# EAGLE design PCB-GPI-JACK (EAGLE 7.7.0)

## Sheet 1 of 2
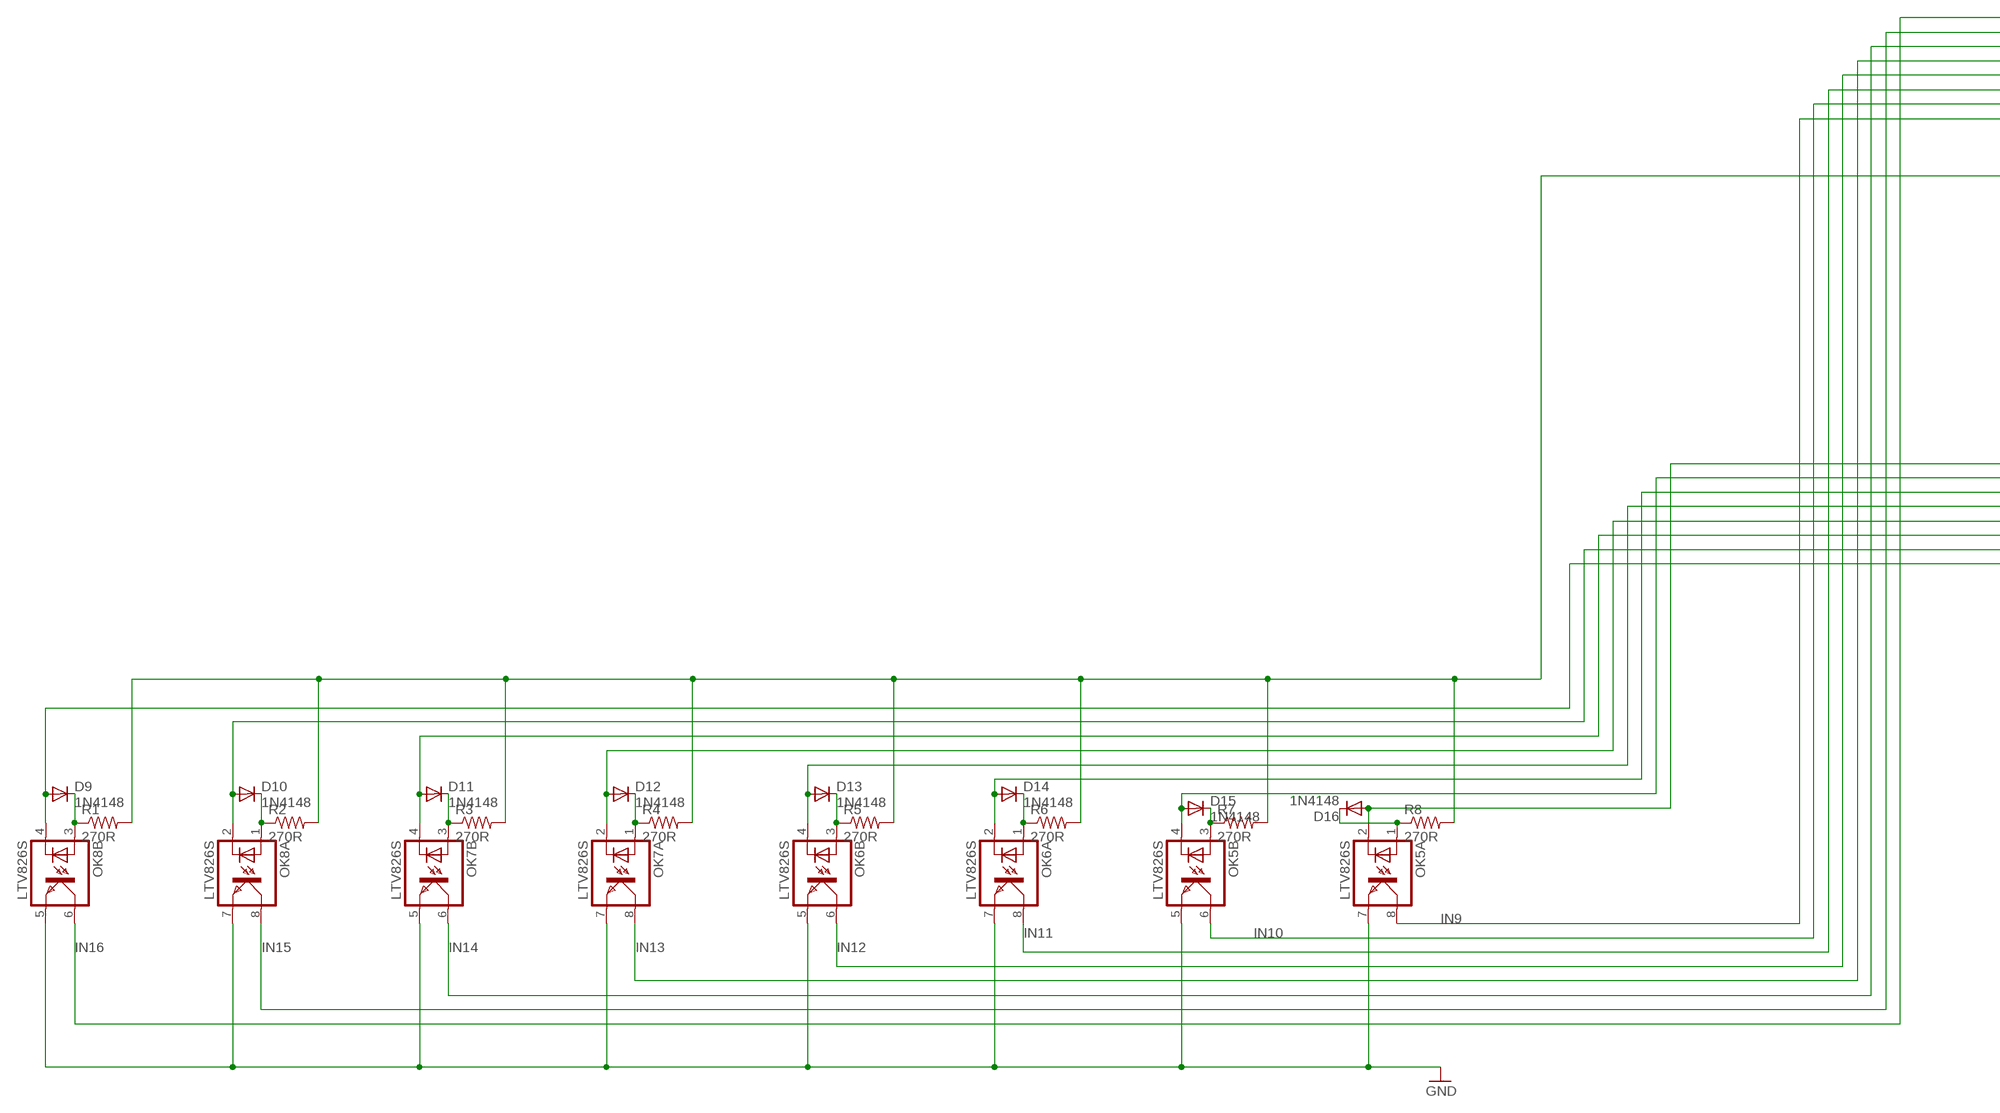
[diagram p0: schematic, sheet 1, part 1 of 2]
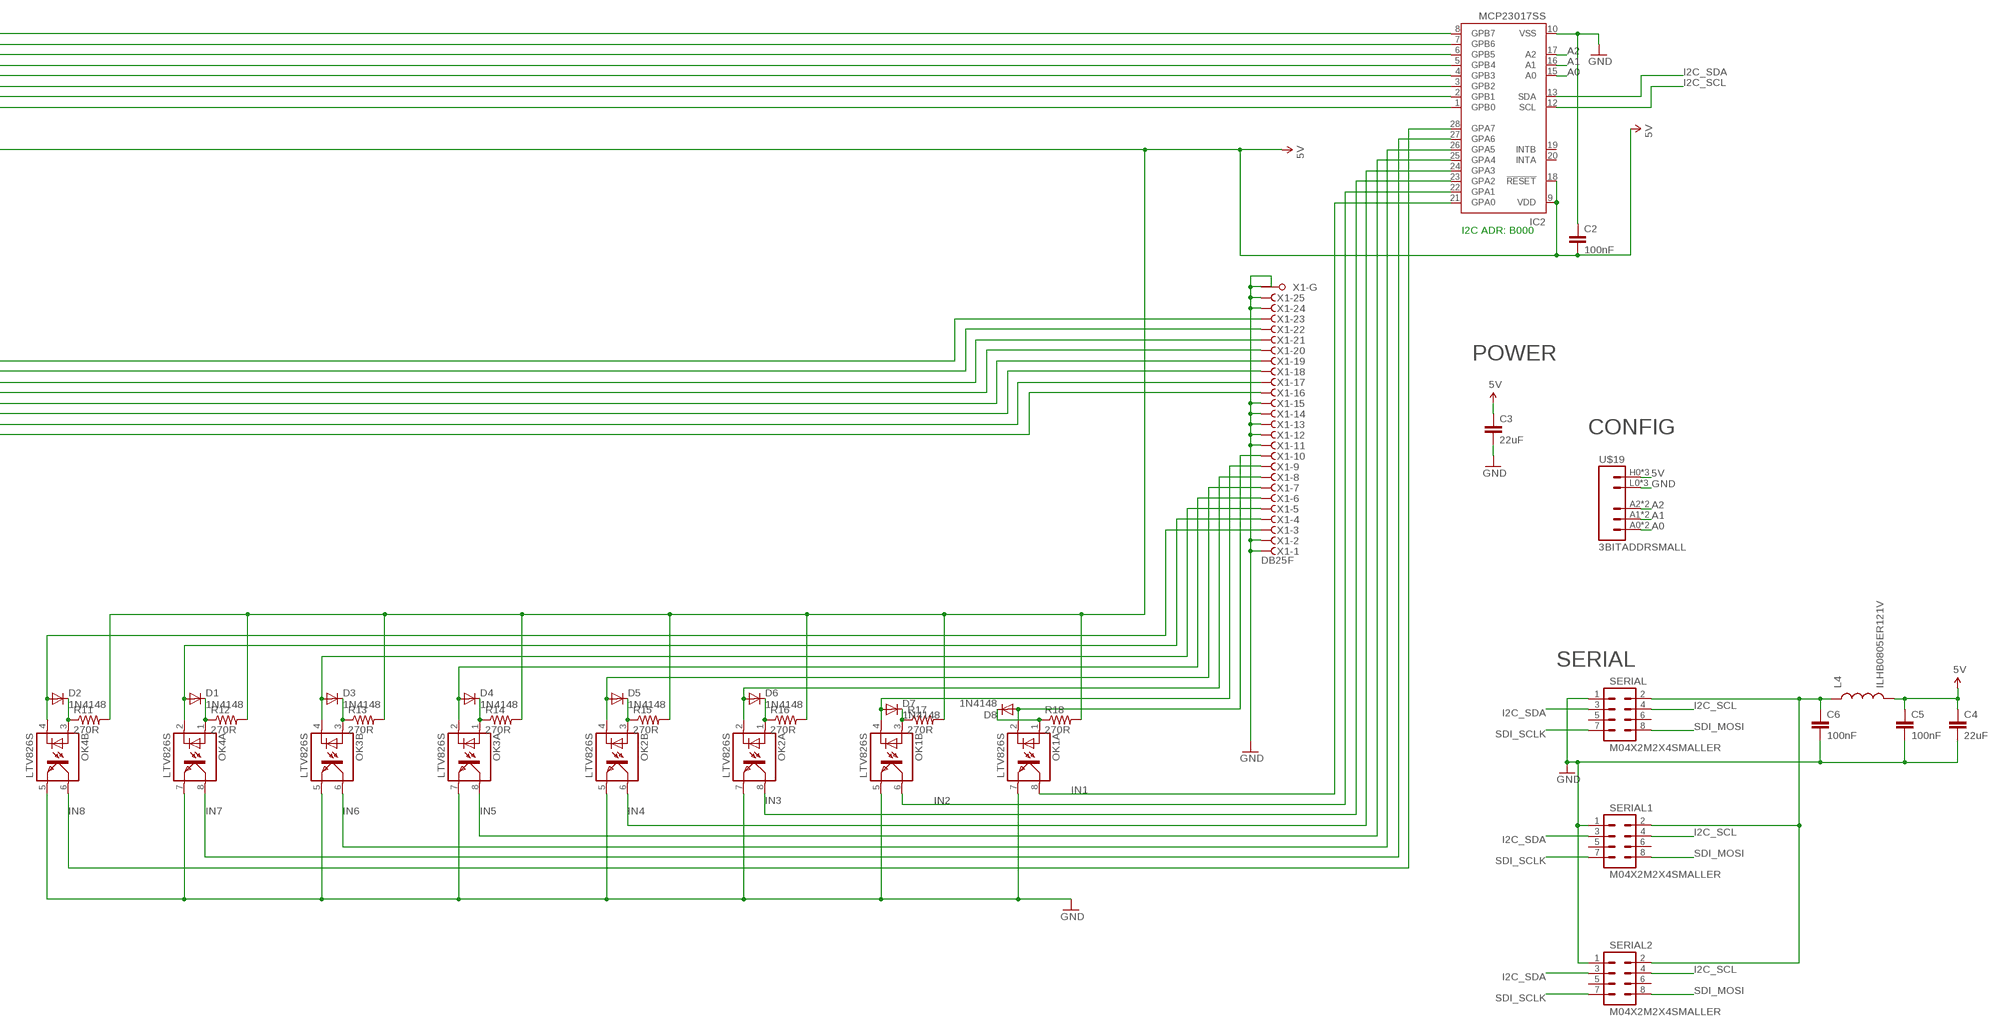
[diagram p1: schematic, sheet 1, part 2 of 2]

### Parts
C2  100nF  CAP0603-CAP  [0603-CAP]
C3  22uF  CAP0805  [0805]
C4  22uF  CAP0805  [0805]
C5  100nF  CAP0603-CAP  [0603-CAP]
C6  100nF  CAP0603-CAP  [0603-CAP]
D1  1N4148  DIODESOD  [SOD-323]
D2  1N4148  DIODESOD  [SOD-323]
D3  1N4148  DIODESOD  [SOD-323]
D4  1N4148  DIODESOD  [SOD-323]
D5  1N4148  DIODESOD  [SOD-323]
D6  1N4148  DIODESOD  [SOD-323]
D7  1N4148  DIODESOD  [SOD-323]
D8  1N4148  DIODESOD  [SOD-323]
D9  1N4148  DIODESOD  [SOD-323]
D10  1N4148  DIODESOD  [SOD-323]
D11  1N4148  DIODESOD  [SOD-323]
D12  1N4148  DIODESOD  [SOD-323]
D13  1N4148  DIODESOD  [SOD-323]
D14  1N4148  DIODESOD  [SOD-323]
D15  1N4148  DIODESOD  [SOD-323]
D16  1N4148  DIODESOD  [SOD-323]
IC2  MCP23017SS  [SSOP28]
L4  ILHB0805ER121V  INDUCTOR0805  [0805]
OK1  LTV826S  [DIL8-SMD]
OK2  LTV826S  [DIL8-SMD]
OK3  LTV826S  [DIL8-SMD]
OK4  LTV826S  [DIL8-SMD]
OK5  LTV826S  [DIL8-SMD]
OK6  LTV826S  [DIL8-SMD]
OK7  LTV826S  [DIL8-SMD]
OK8  LTV826S  [DIL8-SMD]
R1  270R  RESISTOR0603-RES  [0603-RES]
R2  270R  RESISTOR0603-RES  [0603-RES]
R3  270R  RESISTOR0603-RES  [0603-RES]
R4  270R  RESISTOR0603-RES  [0603-RES]
R5  270R  RESISTOR0603-RES  [0603-RES]
R6  270R  RESISTOR0603-RES  [0603-RES]
R7  270R  RESISTOR0603-RES  [0603-RES]
R8  270R  RESISTOR0603-RES  [0603-RES]
R11  270R  RESISTOR0603-RES  [0603-RES]
R12  270R  RESISTOR0603-RES  [0603-RES]
R13  270R  RESISTOR0603-RES  [0603-RES]
R14  270R  RESISTOR0603-RES  [0603-RES]
R15  270R  RESISTOR0603-RES  [0603-RES]
R16  270R  RESISTOR0603-RES  [0603-RES]
R17  270R  RESISTOR0603-RES  [0603-RES]
R18  270R  RESISTOR0603-RES  [0603-RES]
SERIAL  M04X2M2X4SMALLER  [M2X4SMALLER]
SERIAL1  M04X2M2X4SMALLER  [M2X4SMALLER]
SERIAL2  M04X2M2X4SMALLER  [M2X4SMALLER]
U$19  3BITADDRSMALL  [3BITADDR_SMALL]
X1  DB25F  F25HPS  [F25HP]

### Nets
5V [Power]: C2.2 C3.1 C4.1 C5.1 IC2.9(VDD) IC2.18(!RESET) L4.2 R1.2 R2.2 R3.2 R4.2 R5.2 R6.2 R7.2 R8.2 R11.2 R12.2 R13.2 R14.2 R15.2 R16.2 R17.2 R18.2 U$19.H0(VCC) U$19.H1(VCC) U$19.H2(VCC)
A0: IC2.15(A0) U$19.A0 U$19.AS0(A0)
A1: IC2.16(A1) U$19.A1 U$19.AS1(A1)
A2: IC2.17(A2) U$19.A2 U$19.AS2(A2)
GND [Power]: C2.1 C3.2 C4.2 C5.2 C6.2 IC2.10(VSS) OK1.5(B:EMIT) OK1.7(A:EMIT) OK2.5(B:EMIT) OK2.7(A:EMIT) OK3.5(B:EMIT) OK3.7(A:EMIT) OK4.5(B:EMIT) OK4.7(A:EMIT) OK5.5(B:EMIT) OK5.7(A:EMIT) OK6.5(B:EMIT) OK6.7(A:EMIT) OK7.5(B:EMIT) OK7.7(A:EMIT) OK8.5(B:EMIT) OK8.7(A:EMIT) SERIAL1.1 SERIAL2.1 SERIAL.1 U$19.L0(GND) U$19.L1(GND) U$19.L2(GND) X1.1(-1:F) X1.2(-2:F) X1.11(-11:F) X1.12(-12:F) X1.13(-13:F) X1.14(-14:F) X1.15(-15:F) X1.24(-24:F) X1.25(-25:F) X1.G1(-G:G1) X1.G2(-G:G2)
I2C_SCL: IC2.12(SCL) SERIAL1.4 SERIAL2.4 SERIAL.4
I2C_SDA: IC2.13(SDA) SERIAL1.3 SERIAL2.3 SERIAL.3
IN1: IC2.21(GPA0) OK1.8(A:COL)
IN2: IC2.22(GPA1) OK1.6(B:COL)
IN3: IC2.23(GPA2) OK2.8(A:COL)
IN4: IC2.24(GPA3) OK2.6(B:COL)
IN5: IC2.25(GPA4) OK3.8(A:COL)
IN6: IC2.26(GPA5) OK3.6(B:COL)
IN7: IC2.27(GPA6) OK4.8(A:COL)
IN8: IC2.28(GPA7) OK4.6(B:COL)
IN9: IC2.1(GPB0) OK5.8(A:COL)
IN10: IC2.2(GPB1) OK5.6(B:COL)
IN11: IC2.3(GPB2) OK6.8(A:COL)
IN12: IC2.4(GPB3) OK6.6(B:COL)
IN13: IC2.5(GPB4) OK7.8(A:COL)
IN14: IC2.6(GPB5) OK7.6(B:COL)
IN15: IC2.7(GPB6) OK8.8(A:COL)
IN16: IC2.8(GPB7) OK8.6(B:COL)
N$1 [INput lines]: D16.2(A) OK5.2(A:C) X1.23(-23:F)
N$3 [Power]: C6.1 L4.1 SERIAL1.2 SERIAL2.2 SERIAL.2
N$4 [INput lines]: D12.2(A) OK7.2(A:C) X1.19(-19:F)
N$6 [INput lines]: D15.2(A) OK5.4(B:C) X1.22(-22:F)
N$7 [INput lines]: D14.2(A) OK6.2(A:C) X1.21(-21:F)
N$8 [INput lines]: D13.2(A) OK6.4(B:C) X1.20(-20:F)
N$9 [INput lines]: D11.2(A) OK7.4(B:C) X1.18(-18:F)
N$10 [INput lines]: D10.2(A) OK8.2(A:C) X1.17(-17:F)
N$11 [INput lines]: D9.2(A) OK8.4(B:C) X1.16(-16:F)
N$12: D9.1(C) OK8.3(B:A) R1.1
N$13: D2.1(C) OK4.3(B:A) R11.1
N$14: D10.1(C) OK8.1(A:A) R2.1
N$15: D1.1(C) OK4.1(A:A) R12.1
N$16: D3.1(C) OK3.3(B:A) R13.1
N$17: D4.1(C) OK3.1(A:A) R14.1
N$18: D11.1(C) OK7.3(B:A) R3.1
N$19: D5.1(C) OK2.3(B:A) R15.1
N$20: D6.1(C) OK2.1(A:A) R16.1
N$21: D7.1(C) OK1.3(B:A) R17.1
N$22: D12.1(C) OK7.1(A:A) R4.1
N$23: D8.1(C) OK1.1(A:A) R18.1
N$24: D13.1(C) OK6.3(B:A) R5.1
N$25: D14.1(C) OK6.1(A:A) R6.1
N$26: D15.1(C) OK5.3(B:A) R7.1
N$27: D16.1(C) OK5.1(A:A) R8.1
N$49 [INput lines]: D8.2(A) OK1.2(A:C) X1.10(-10:F)
N$55 [INput lines]: D4.2(A) OK3.2(A:C) X1.6(-6:F)
N$60 [INput lines]: D7.2(A) OK1.4(B:C) X1.9(-9:F)
N$61 [INput lines]: D6.2(A) OK2.2(A:C) X1.8(-8:F)
N$62 [INput lines]: D5.2(A) OK2.4(B:C) X1.7(-7:F)
N$64 [INput lines]: D3.2(A) OK3.4(B:C) X1.5(-5:F)
N$65 [INput lines]: D1.2(A) OK4.2(A:C) X1.4(-4:F)
N$66 [INput lines]: D2.2(A) OK4.4(B:C) X1.3(-3:F)
SDI_MOSI: SERIAL1.8 SERIAL2.8 SERIAL.8
SDI_SCLK: SERIAL1.7 SERIAL2.7 SERIAL.7
Unconnected: IC2.19(INTB) IC2.20(INTA) SERIAL1.5 SERIAL1.6 SERIAL2.5 SERIAL2.6 SERIAL.5 SERIAL.6

### Notes on the sheet
- I2C ADR: B000
- POWER
- CONFIG
- SERIAL

## Sheet 2 of 2

## Library data of the parts
C2-C6 = SparkFun:CAP: Capacitor Standard 0603 ceramic capacitor, and 0.1" leaded capacitor.
D1-D16 = SparkFun:DIODE: Diode These are standard reverse protection diodes and small signal diodes. SMA package can handle up to about 1A. SOD-323 can handle about 200mA. What the SOD-323 package when ordering, there are some mfgs out there that are 5-pin packages.
IC2 = microchip:MCP23017: http://ww1.microchip.com/downloads/en/DeviceDoc/21952a.pdf Source: http://ww1.microchip.com/downloads/en/DeviceDoc/21952a.pdf; MF: MICROCHIP; MPN: MCP23017-E/SS; OC_FARNELL: 1467674; OC_NEWARK: 31K2960
L4 = SparkFun:INDUCTOR: Inductors Basic Inductor/Choke - 0603 and 1206. Footprints are not proven and vary greatly between part numbers.
OK1-OK8 = optocoupler:LTV826: OPTO COUPLER Source: LITEON, LTV816.pdf; OC_FARNELL: unknown; OC_NEWARK: unknown
R1-R8 R11-R18 = SparkFun:RESISTOR: Resistor Basic schematic elements and footprints for 0603, 1206, and PTH resistors.
SERIAL SERIAL1 SERIAL2 = SKAARHOJ:M04X2
U$19 = SKAARHOJ:3BITADDR
X1 = con-subd:F25HPS: SUB-D; OC_FARNELL: unknown; OC_NEWARK: unknown

## Net classes
0 default: width 0.203 mm, drill 0.406 mm, clearance 0.203 mm
1 Power: width 0.406 mm, drill 0.61 mm, clearance 0.203 mm
2 RELAY LINES: width 0.305 mm, drill 0.406 mm, clearance 0.254 mm
3 INput lines: width 0.203 mm, drill 0.406 mm, clearance 0.254 mm

## Board
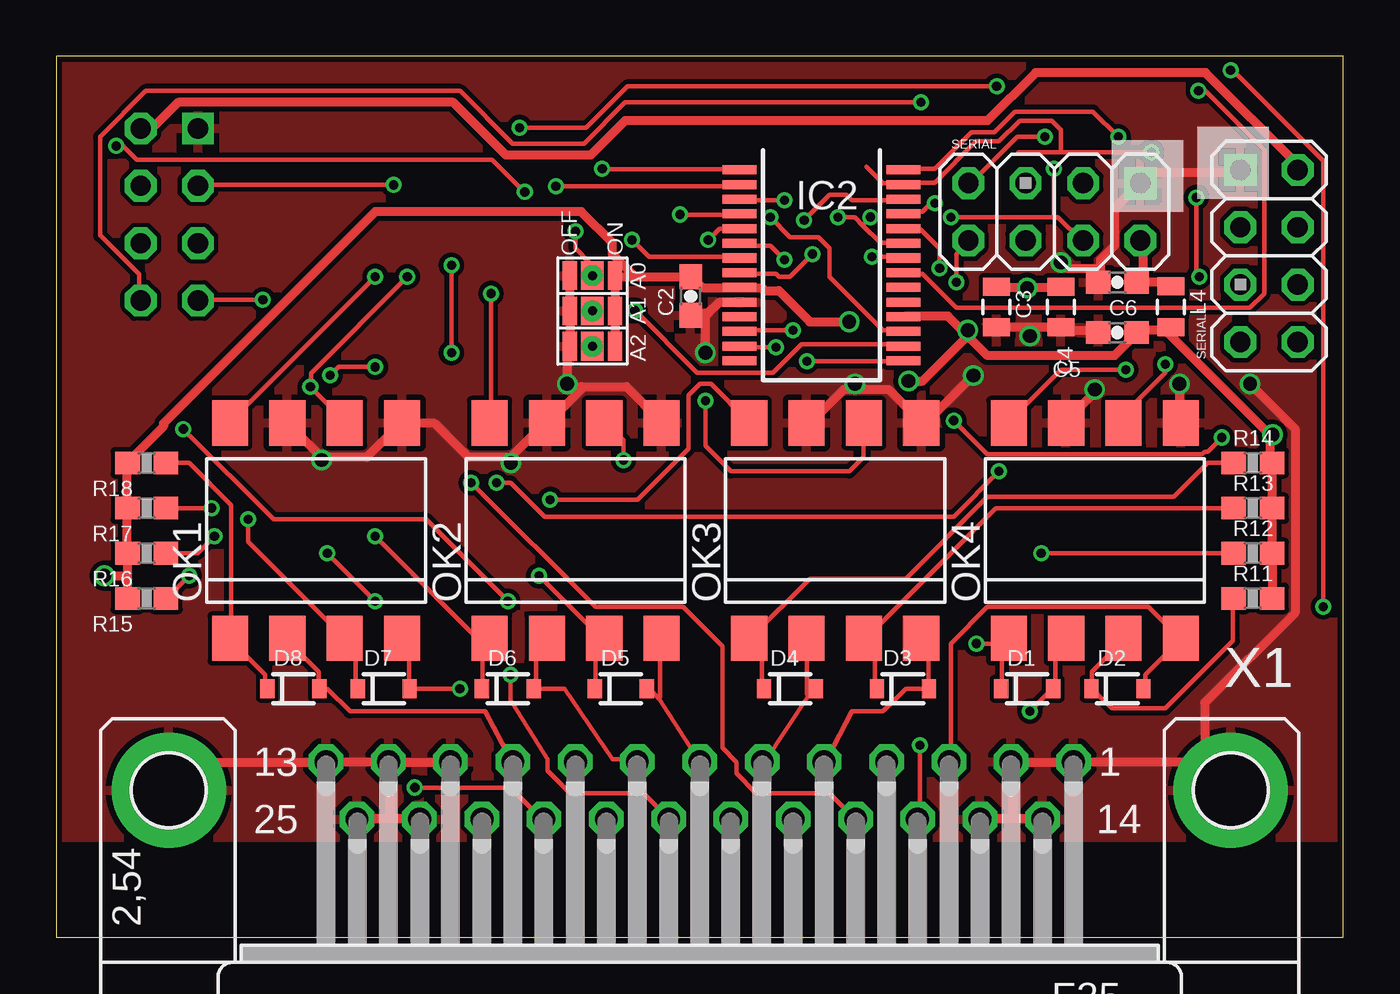
[diagram p2: board, top side]
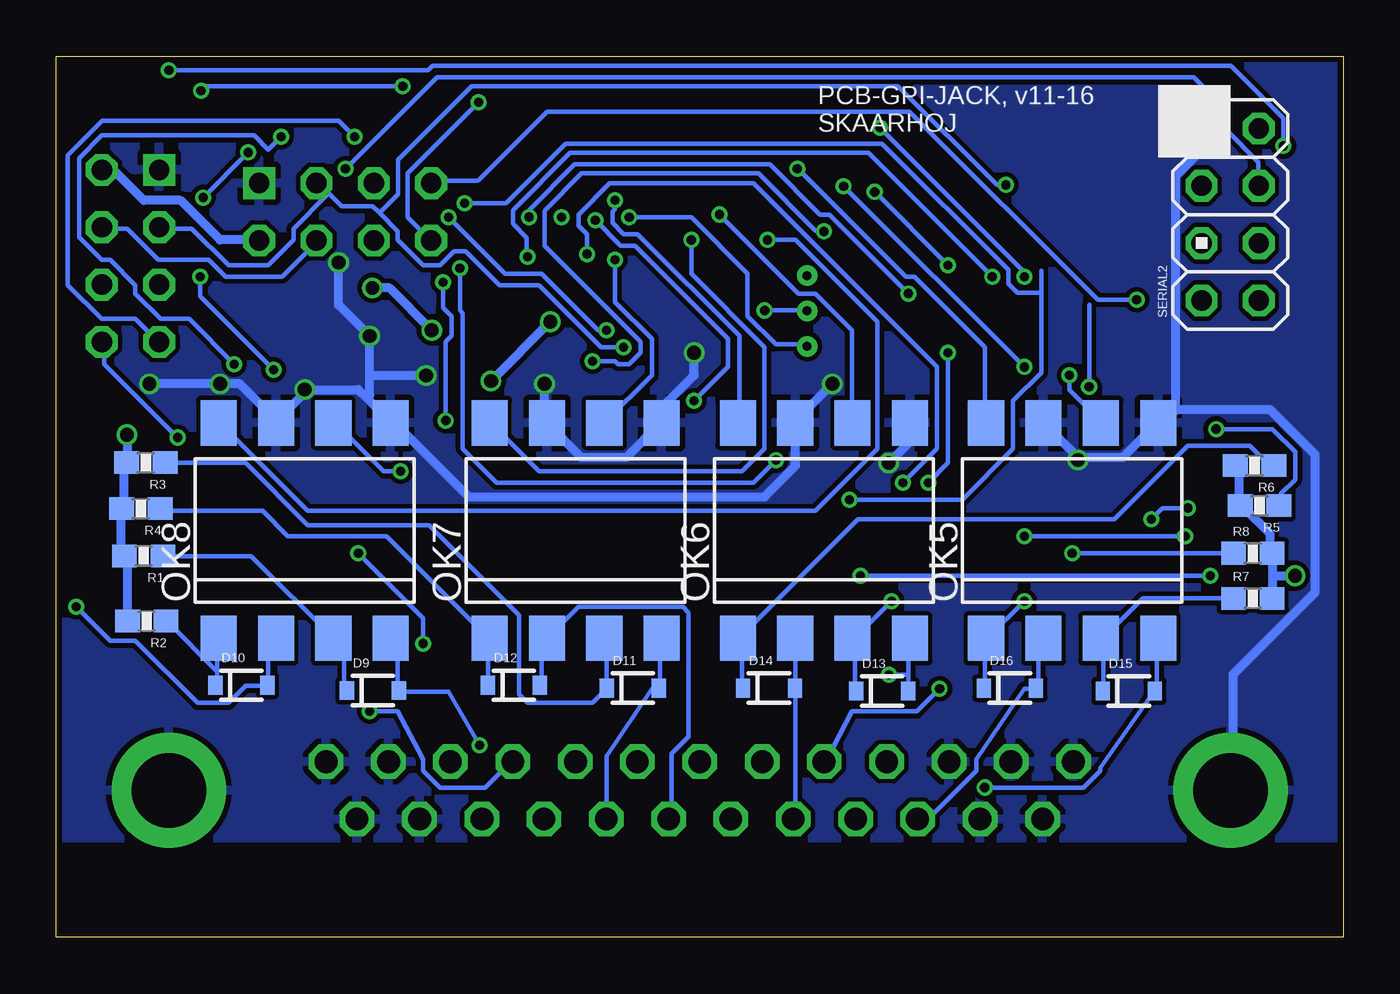
[diagram p3: board, bottom side, seen from below]

Size 57 x 39 mm. Coordinates in mm from the lower left corner, seen from the top.
Outline: 57,0 57,39 0,39 0,0 57,0
Copper layers (1*16): Top 0.035mm / dielectric 1.5mm / Bottom 0.035mm
Design rules "Fusion_eagle_rule_v1.1": minimum track width 6mil, minimum drill 12mil, track to track 6mil, track to pad 6mil, pad to pad 6mil, via to via 6mil, smd to smd 0mil, copper to edge 10mil, drill to drill 10mil, minimum pad ring 10mil, minimum via ring 6mil, stop-mask expansion 2mil, vias tented up to drill 100mil, thermal gap 10mil
tRestrict: area 0,0 to 57,4
bRestrict: area 0,0 to 57,4

### Footprints (pad centres in the part's own frame; a part is rotated, then mirrored left to right if it is on the bottom)
0603-CAP = smd 1.1 x 1: 1 -0.85,0; 2 0.85,0
0805 = smd 0.8 x 1.2: 1 -0.9,0; 2 0.9,0
SOD-323 = smd 0.63 x 0.83: 1 -1.15,0; 2 1.15,0
SSOP28 = smd 0.4 x 1.5: 1 -4.225,-3.625; 2 -3.575,-3.625; 3 -2.925,-3.625; 4 -2.275,-3.625; 5 -1.625,-3.625; 6 -0.975,-3.625; 7 -0.325,-3.625; 8 0.325,-3.625; 9 0.975,-3.625; 10 1.625,-3.625; 11 2.275,-3.625; 12 2.925,-3.625; 13 3.575,-3.625; 14 4.225,-3.625; 15 4.225,3.625; 16 3.575,3.625; 17 2.925,3.625; 18 2.275,3.625; 19 1.625,3.625; 20 0.975,3.625; 21 0.325,3.625; 22 -0.325,3.625; 23 -0.975,3.625; 24 -1.625,3.625; 25 -2.275,3.625; 26 -2.925,3.625; 27 -3.575,3.625; 28 -4.225,3.625
DIL8-SMD = smd 1.6 x 2: 1 -3.81,-4.77; 2 -1.27,-4.77; 3 1.27,-4.77; 4 3.81,-4.77; 5 3.81,4.77; 6 1.27,4.77; 7 -1.27,4.77; 8 -3.81,4.77
0603-RES = smd 1.1 x 1: 1 -0.85,0; 2 0.85,0
M2X4SMALLER = drill 0.9 square: 1 -1.27,3.81 | drill 0.9 octagon: 2 1.27,3.81; 3 -1.27,1.27; 4 1.27,1.27; 5 -1.27,-1.27; 6 1.27,-1.27; 7 -1.27,-3.81; 8 1.27,-3.81
3BITADDR_SMALL = drill 0.4: A0 -1.565,0; A1 0,0; A2 1.565,0 | smd 1.27 x 1: AS0 -1.565,0; AS1 0,0; AS2 1.565,0 | smd 1.27 x 0.635: H0 -1.565,1; H1 0,1; H2 1.565,1; L0 -1.565,-1; L1 0,-1; L2 1.565,-1
F25HP = drill 1.016 octagon: 1 -16.561,-1.27; 2 -13.792,-1.27; 3 -11.049,-1.27; 4 -8.28,-1.27; 5 -5.512,-1.27; 6 -2.769,-1.27; 7 0,-1.27; 8 2.769,-1.27; 9 5.512,-1.27; 10 8.28,-1.27; 11 11.049,-1.27; 12 13.792,-1.27; 13 16.561,-1.27; 14 -15.189,1.27; 15 -12.421,1.27; 16 -9.652,1.27; 17 -6.909,1.27; 18 -4.14,1.27; 19 -1.372,1.27; 20 1.372,1.27; 21 4.14,1.27; 22 6.909,1.27; 23 9.652,1.27; 24 12.421,1.27; 25 15.189,1.27 | drill 3.302 pad 5.08: G1 -23.52,0; G2 23.52,0

### Placement (x,y rotation side)
C2  28.1,28.39 90 top
C3  41.65,27.9 270 top
C4  44.49,27.9 270 top
C5  47,26.77 180 top
C6  47,29 180 top
D1  43,11 0 top
D2  47,11 0 top
D3  37.5,11 0 top
D4  32.5,11 0 top
D5  25,11 0 top
D6  20,11 0 top
D7  14.5,11 0 top
D8  10.5,11 0 top
D9  42.98,10.92 0 bottom
D10  48.8,11.15 0 bottom
D11  31.47,11.02 0 bottom
D12  36.74,11.15 0 bottom
D13  20.42,10.9 0 bottom
D14  25.43,11.02 0 bottom
D15  9.49,10.9 0 bottom
D16  14.76,11.02 0 bottom
IC2  33.89,29.75 270 top
L4  49.37,27.91 270 top
OK1  11.5,18 0 top
OK2  23,18 0 top
OK3  34.5,18 0 top
OK4  46,18 0 top
OK5  12,18 0 bottom
OK6  23,18 0 bottom
OK7  34,18 0 bottom
OK8  46,18 0 bottom
R1  53.13,16.88 180 bottom
R2  53,14 180 bottom
R3  53.04,21.01 180 bottom
R4  53.26,18.98 180 bottom
R5  3.7,19.11 180 bottom
R6  3.92,20.88 180 bottom
R7  4,15 0 bottom
R8  4,17 0 bottom
R11  53,15 0 top
R12  53,17 0 top
R13  53,19 0 top
R14  53,21 0 top
R15  4,15 180 top
R16  4,17 180 top
R17  4,19 180 top
R18  4,21 180 top
SERIAL  44.21,32.12 270 top
SERIAL1  53.72,30.17 0 top
SERIAL2  5,32 0 bottom
U$19  23.75,27.73 270 top
X1  28.5,6.5 180 top

### Tracks (layer width: path | path; a pad name or v marks a point on that pad's centre or on a via)
5V  (via drill 0.61)
  Top 0.406: R11.2 53.88,15 53.88,17 R12.2 53.88,17.12 53.88,19 R13.2 53.88,19.12 53.88,21 R14.2 53.75,21.12 53.75,22.25 | C3.1 41.75,28.75 v43,28.75 44.38,28.75 C4.1 | 40.25,26.75 41.25,25.75 46.88,25.75 47.75,26.62 C5.1 47.88,26.88 49.12,26.88 49.25,27 L4.2 49.25,26.75 53.75,22.25 | 40.25,26.75 39.5,27.5 37.62,27.5 IC2.18 | 40.25,26.75 v40.38,26.88 40.25,26.5 38.38,24.62 v37.75,24.62 | v53.88,22.25 53.75,22.25 | 3.12,16 3.12,17 R8.2 3.12,17.12 3.12,19 R17.2 3.12,19.12 3.12,21 R18.2 3.25,21.12 4.75,22.62 4.75,22.75 14.12,32.12 23.25,32.12 24.62,30.75 24.62,30.25 25.5,29.38 25.5,29.25 | 3.12,16 3.12,15 R7.2 | v2.12,16 3.12,16 | U$19.H2 24.75,26.25 24.75,27.62 U$19.H1 24.75,27.88 24.75,29.12 U$19.H0 24.75,29.25 25.5,29.25 | 25.5,29.25 28,29.25 C2.2 28.25,29.12 28.62,28.75 30.25,28.75 IC2.9 30.38,28.75 31.25,28.75 31.38,28.62 32,28.62 33.38,27.25 v35.12,27.25
  Bottom 0.406: R2.2 53.88,14 53.88,16.88 R1.2 54.12,17 54.12,18.88 R4.2 54,19.12 54,21 R3.2 53.88,21.12 v53.88,22.25 | v43,28.75 42.25,28.75 v40.38,26.88 | 3.12,16 3.12,17 R8.2 3.25,17.12 3.25,17.88 4.38,19 R5.2 4.62,19.12 4.62,20.75 4.75,20.88 R6.2 | 3.12,16 3.12,15 R7.2 | 3.12,16 v2.12,16 | v35.12,27.25 v37.75,24.62
A0  (via drill 0.41)
  Top 0.203: 23.75,29.25 U$19.AS0 23.62,29.38 23.62,29.88 23,30.5 v23,31.25 | v33.25,25.5 37.5,25.5 IC2.15
  Bottom 0.203: v33.25,25.5 32.25,25.5 32.12,25.38 31.62,25.38 31.12,25.88 31.12,26.38 35.38,30.62 35.38,32.12 35.36,32.19 33.73,33.82 25.91,33.82 23.37,31.28 23.06,31.28 v23,31.25
A1  (via drill 0.41)
  Top 0.203: 23.75,27.75 U$19.AS1 | v25.62,27.75 28.38,25 31.75,25 33,26.25 37.5,26.25 IC2.16
  Bottom 0.203: v25.62,27.75 23.75,27.75 U$19.AS1
A2  (via drill 0.41)
  Top 0.203: 23.75,26.12 U$19.AS2 | v31.62,31.88 32.5,31 33.75,31 34.25,30.5 34.25,29.25 36.62,26.88 37.5,26.88 IC2.17
  Bottom 0.203: v31.62,31.88 28.88,31.88 26.38,29.38 26.38,27.5 25.12,26.25 23.75,26.25 U$19.AS2
GND  (via drill 0.61)
  Top 0.406: 14.75,5.25 16,5.25 X1.24 | 14.75,5.25 13.38,5.25 X1.25 | X1.12 14.62,7.75 12,7.75 X1.13 11.75,7.75 6.25,7.75 5,6.5 X1.G2 | X1.11 17.38,7.75 14.88,7.75 X1.12 | 14.75,5.25 14.75,7.62 X1.12 | 42.38,5.25 43.62,5.25 X1.14 | 42.38,5.25 41,5.25 X1.15 | 42.38,5.25 42.38,7.75 X1.2 42.5,7.75 45,7.75 X1.1 45.25,7.75 50.75,7.75 52,6.5 X1.G1 50.88,7.88 50.88,10.38 54.88,14.38 54.88,22.5 v52.88,24.5 | 11.75,21.25 OK1.7 | 11.75,21.25 13.75,21.25 15.25,22.75 OK1.5 15.5,22.75 16.75,22.75 18.25,21.25 20,21.25 v20.12,21 20.12,21.25 21.62,22.75 OK2.7 21.88,22.88 23.25,24.25 23.25,24.38 | v11.75,21.12 11.75,21.25 | U$19.L0 22.75,29.25 22.75,27.88 U$19.L1 22.75,27.62 22.75,26.25 U$19.L2 22.62,26 v22.62,24.5 22.75,24.38 23.25,24.38 | 23.25,24.38 25.25,24.38 26.75,22.88 OK2.5 | 35.38,24.25 36.88,24.25 38.25,22.88 OK3.5 38.5,22.75 v40.62,24.88 | 35.38,24.25 34.88,24.25 33.5,22.88 33.25,22.88 OK3.7 | 28.75,27.62 28.88,27.62 29.38,28.12 IC2.10 | 28.75,27.62 28.12,27.62 C2.1 | v28.75,25.88 28.75,27.62 | v35.38,24.5 35.38,24.25 | 46.25,29.62 46.25,30 46.88,30.62 46.88,32.25 48,33.38 SERIAL.1 48.12,33.5 48.5,33.88 52.38,33.88 SERIAL1.1 | 46.25,29.62 46.25,29 C6.2 | C5.2 46.12,26.88 44.5,26.88 C4.2 44.38,27 43.12,27 | 43.12,27 41.75,27 C3.2 | v46,24.25 46,24.12 44.75,22.88 OK4.7 | v49.75,24.5 49.75,22.88 OK4.5 | v43.12,26.62 43.12,27 | 46.25,29.62 44.75,29.62 v44.5,29.88
  Bottom 0.406: 11.75,21.25 9.75,21.25 8.25,22.75 OK5.5 | OK5.7 11.75,21.25 | v11.75,21.12 11.75,21.25 | v20.12,21 19.25,21.88 19.25,22.75 OK6.5 | v22.62,24.5 24.25,22.88 OK6.7 24.25,22.62 24.25,20.88 25.62,19.5 38.75,19.5 42,22.75 OK8.5 42.25,22.88 43.25,23.88 | v28.75,25.88 28.75,24.88 30.12,23.5 30.12,22.88 OK7.5 30.25,22.75 31.75,21.25 33.75,21.25 OK7.7 35.38,22.88 v35.38,24.5 | 43.25,23.88 43.62,24.25 45.88,24.25 | 45.88,24.25 47.25,22.88 OK8.7 47.38,23 48.88,24.5 v49.75,24.5 v52.88,24.5 | v46,24.25 45.88,24.25 | 43.12,24.88 43.12,24 43.25,23.88 | 43.12,24.88 v43.12,26.62 44.5,28 v44.5,29.88 | 43.12,24.88 v40.62,24.88 | X1.G2 4.88,6.5 4.88,11.62 1.25,15.25 1.25,21.38 3.25,23.38 7.38,23.38 8,22.75 OK5.5 | SERIAL2.1 6.3,35.75 6.3,34.83 7.42,33.72 7.42,23.55 OK5.5
  pour Top: 0,0 57,0 57,39 0,39
  pour Bottom: 0,0 57,0 57,39 0,39
I2C_SCL  (via drill 0.41)
  Top 0.203: v32.62,26.88 30.38,26.88 IC2.12 | 44.2,31.88 44.38,31.88 45.38,30.88 SERIAL.4 | 44.2,31.88 v39.62,31.88 | 44.2,31.88 v44.2,34.02
  Bottom 0.203: v32.62,26.88 33,26.88 35.5,29.38 37.12,29.38 v39.62,31.88 | SERIAL1.4 54.88,31.38 53.88,31.38 52.5,30 50.25,30 49.5,29.25 47,29.25 45.5,30.75 SERIAL.4 | v44.2,34.02 40.13,38.08 6.6,38.08 5.18,36.66 5.18,35.75 3.76,34.33 3.76,33.31 SERIAL2.4
I2C_SDA  (via drill 0.41)
  Top 0.203: v31.88,26.12 30.38,26.12 IC2.13 | v14.94,33.31 6.3,33.31 SERIAL2.3
  Bottom 0.203: v31.88,26.12 32.88,26.12 35.62,28.88 37.38,28.88 38.88,30.38 39.38,30.38 40,29.75 40.75,29.75 41.88,30.88 41.88,31.25 42.69,32.07 | 42.69,32.07 43,32.38 44.38,32.38 45.38,33.38 SERIAL.3 45,32.88 46.5,31.38 46.5,30.88 47.62,29.75 49.38,29.75 51,31.38 52.38,31.38 SERIAL1.3 | v14.94,33.31 15.34,33.31 19.71,37.68 38.61,37.68 41.86,34.43 41.86,32.9 42.69,32.07
IN1  (via drill 0.41)
  Top 0.203: v14.12,29.25 7.75,22.88 OK1.8 | IC2.21 37.62,29.38 38.38,29.38 39.88,27.88 52.88,27.88 53.5,28.5 53.5,34.88 50.88,37.5 50.8,37.47 v50.6,37.47 | v20.52,35.85 23.47,35.85 25.3,37.68 v41.66,37.68
  Bottom 0.203: v20.52,35.85 14.22,29.55 14.22,29.35 v14.12,29.25 | v41.66,37.68 50.39,37.68 v50.6,37.47
IN2  (via drill 0.41)
  Top 0.203: v36.12,30.12 37.5,30.12 IC2.22 | OK1.6 12.75,22.88 v11.25,24.38 11.28,24.47 11.28,24.98 v15.54,29.25
  Bottom 0.203: v11.25,24.38 11.25,28 | v15.54,29.25 21.03,34.73 34.24,34.73 36.78,32.19 36.78,31.58 36.17,30.97 36.17,30.16 v36.12,30.12
IN3  (via drill 0.41)
  Top 0.203: 35.72,31.53 35.38,31.88 v34.62,31.88 | 35.72,31.53 36.5,30.75 37.5,30.75 IC2.23 | v19.25,28.5 19.25,22.88 OK2.8 | v36.07,31.89 35.72,31.53
  Bottom 0.203: v36.07,31.89 36.07,32.19 34.04,34.22 25.4,34.22 23.16,31.99 22.76,31.99 19.3,28.53 v19.25,28.5
IN4  (via drill 0.41)
  Top 0.203: IC2.24 38.25,31.38 39.12,30.5 v39.12,29.62 | v25.12,21.12 25.12,22 24.38,22.75 OK2.6
  Bottom 0.203: v39.12,29.62 39.12,27.75 39,27.62 39,21.62 37.5,20.12 26.12,20.12 v25.12,21.12
IN5  (via drill 0.41)
  Top 0.203: v21.88,19.38 25.75,19.38 28,21.62 28,24 28.5,24.5 29,24.5 30.62,22.88 OK3.8 | IC2.25 37.62,32.12 38.38,32.12 38.75,32.5 38.81,32.5 v38.91,32.5
  Bottom 0.203: 13.38,28.53 13.38,25 14.62,23.75 14.62,21.62 16.88,19.38 v21.88,19.38 | 13.38,28.53 13.38,29.5 | v38.91,32.5 37.08,32.5 34.44,35.14 20.42,35.14 14.83,29.55 14.83,28.94 14.43,28.53 13.38,28.53
IN6  (via drill 0.41)
  Top 0.203: v33.12,31.75 34.25,32.88 35,32.88 35.25,32.62 37.5,32.62 IC2.26 | v28.75,23.75 28.75,21.75 29.88,20.62 35.12,20.62 35.75,21.25 35.75,22.75 OK3.6
  Bottom 0.203: v33.12,31.75 32,30.62 31.38,30.62 27.25,26.5 27.25,25.25 v28.75,23.75
IN7  (via drill 0.41)
  Top 0.203: 35.88,34.12 36.62,33.38 37.5,33.38 IC2.27 37.59,33.41 38.91,33.41 40.74,35.24 41.76,35.24 42.67,36.15 44.09,36.15 44.5,35.75 44.5,34.75 | v48.5,34.75 44.5,34.75 | 44.5,34.75 42.62,34.75 | v50.5,32.75 50.5,29.38 v50.62,29.25 | v47.38,25.12 44.5,25.12 42.25,22.88 OK4.8
  Bottom 0.203: v50.5,32.75 v48.5,34.75 | v50.62,29.25 50.62,28.38 v47.38,25.12
IN8  (via drill 0.41)
  Top 0.203: v49.12,25.38 49.12,25 47.38,23.25 47.38,22.88 OK4.6 | 37.62,34 IC2.28 37.69,34.02 38.91,34.02 40.54,35.65 41.55,35.65 42.47,36.56 45.92,36.56 v47.04,35.44
  Bottom 0.203: v49.12,25.38 51.12,27.38 52.38,27.38 53.5,28.5 53.5,28.88 54.62,30 55,30 56,31 56,34.5 55,35.5 48.25,35.5 47.62,34.88 47.55,34.93 v47.04,35.44
IN9  (via drill 0.41)
  Top 0.203: IC2.1 30.25,34 24.5,34 24.49,34.02 v24.18,34.02
  Bottom 0.203: OK5.8 15.88,22.88 15.88,26.12 19,29.25 19.38,29.25 24.12,34 v24.18,34.02
IN10  (via drill 0.41)
  Top 0.203: v22.12,33.25 30.25,33.25 IC2.2 | v14.12,25.25 12.5,25.25 v12.12,24.88
  Bottom 0.203: v14.12,25.25 v22.12,33.25 | v12.12,24.88 12.12,24.25 10.75,22.88 OK5.6
IN11  (via drill 0.41)
  Top 0.203: v32.25,32.62 30.38,32.62 IC2.3
  Bottom 0.203: v32.25,32.62 32.25,32.25 32.38,32.12 32.38,31.62 31.88,31.12 31.25,31.12 26.75,26.62 26.75,22.88 OK6.8
IN12  (via drill 0.41)
  Top 0.203: v27.62,32 30.25,32 IC2.4
  Bottom 0.203: v27.62,32 24.12,28.5 23.38,28.5 21.75,26.88 21.75,22.88 OK6.6
IN13  (via drill 0.41)
  Top 0.203: IC2.5 29.38,31.38 v28.88,30.88
  Bottom 0.203: v28.88,30.88 28.88,29.38 25.62,26.12 25.62,21.62 26.62,20.62 35.62,20.62 37.75,22.75 OK7.8
IN14  (via drill 0.41)
  Top 0.203: v32.25,30 31.62,30.62 30.38,30.62 IC2.6
  Bottom 0.203: v32.25,30 32.25,28.12 30.62,26.5 30.62,24.88 OK7.6
IN15  (via drill 0.41)
  Top 0.203: v25.5,30.88 26.25,30.12 30.25,30.12 IC2.7
  Bottom 0.203: v25.5,30.88 24.25,30.88 20.62,27.25 20.62,21.62 23.38,18.88 45.88,18.88 49.75,22.75 OK8.8
IN16  (via drill 0.41)
  Top 0.203: v33.5,30.25 32.5,29.25 32,29.25 31.88,29.38 30.38,29.38 IC2.8 | v19.5,20.12 20.12,20.12 21.62,18.62 39.75,18.62 v41.75,20.62
  Bottom 0.203: v33.5,30.25 33.5,31.12 33.88,31.5 33.88,32 32.5,33.38 26.12,33.38 18,25.25 18,21.62 v19.5,20.12 | v41.75,20.62 42.5,20.62 44.62,22.75 OK8.6
N$1
  Bottom 0.203: OK5.2 13.5,13 13.5,11.12 D16.2 13.62,11 14.12,11 16.25,7.88 16.25,7.38 18.38,5.25 18.75,5.25 X1.23
N$3
  Top 0.406: L4.1 49.25,28.88 49.12,29 C6.1 48.12,29.12 48.12,30.75 SERIAL.2 | SERIAL2.2 3.76,35.85 4.27,35.85 5.38,36.97 17.58,36.97 19.91,34.63 23.67,34.63 25.2,36.15 41.25,36.15 43.38,38.29 50.9,38.29 54.97,34.22 54.97,34.02 SERIAL1.2
  Bottom 0.406: SERIAL1.2 54.88,33.88 54.38,33.88 53.12,32.62 51.5,32.62 49.75,30.88 48.12,30.88 SERIAL.2
N$4
  Bottom 0.203: D12.2 35.5,11.25 35.5,13 OK7.2 33.88,14.62 29.25,14.62 29,14.38 29,8.88 29.75,8.12 29.75,5.25 X1.19
N$6  (via drill 0.41)
  Top 0.203: v15.88,6.62 20.12,6.62 21.5,5.25 X1.22
  Bottom 0.203: OK5.4 8.25,13.12 8.25,11 D15.2 8.38,10.88 10.75,7.5 10.75,7.38 11.5,6.62 v15.88,6.62
N$7
  Bottom 0.203: OK6.2 24.25,13.12 24.25,11.12 D14.2 24.25,11 24.25,5.25 X1.21
N$8  (via drill 0.41)
  Top 0.203: v20.12,11.62 20.12,10.5 21.75,7.88 21.75,7.38 22.75,6.38 26,6.38 27.12,5.25 X1.20
  Bottom 0.203: 19.25,11.62 19.25,13.12 OK6.4 | 19.25,11.62 19.25,11 D13.2 | v20.12,11.62 19.25,11.62
N$9
  Bottom 0.203: OK7.4 30.25,13.12 30.25,11.12 D11.2 30.38,11 30.62,11 32.62,8 32.62,5.25 X1.18
N$10  (via drill 0.41)
  Top 0.203: v56.12,14.62 56.12,34.38 52.06,38.44 | 52,38.5 52.06,38.44 | v17.5,25.88 v17.5,29.75 | v18.38,20.12 23.88,14.62 27.75,14.62 29.5,12.88 29.5,8.38 30.12,7.75 30.12,7.25 31,6.38 34.25,6.38 35.38,5.25 X1.17 | v2.64,35.04 2.95,35.04 3.56,34.43 19.3,34.43 20.73,33 v20.75,33 | v52.02,38.39 52.06,38.44
  Bottom 0.203: OK8.2 47.62,12.88 47.62,11.25 D10.2 47.75,11.12 48.62,11.12 49.38,10.38 50.75,10.38 53.5,13.12 54.62,13.12 v56.12,14.62 | v17.5,29.75 v20.75,33 | v17.5,25.88 17.5,21 v18.38,20.12 | v52.02,38.39 40.54,38.39 40.34,38.59 4.98,38.59 2.64,36.26 v2.64,35.04
N$11  (via drill 0.41)
  Top 0.203: v38.25,8.5 38.25,5.25 X1.16
  Bottom 0.203: OK8.4 42.12,13.12 41.88,12.88 41.88,11 D9.2 41.75,10.88 39.62,10.88 v38.25,8.5
N$12
  Bottom 0.203: D9.1 44.25,11 44.25,12.75 OK8.3 48.38,16.88 52.25,16.88 R1.1
N$13
  Top 0.203: 45.88,11 45.88,11.75 47.25,13.12 OK4.3 | 45.88,11 46.75,10.12 49.12,10.12 52.12,13.12 52.12,15 R11.1 | 45.88,11 D2.1
N$14
  Bottom 0.203: 49.88,11.75 49.88,13.12 OK8.1 | 49.88,11.75 49.88,11.25 D10.1 | 49.88,11.75 52.12,14 R2.1
N$15  (via drill 0.41)
  Top 0.203: D1.1 41.88,11 41.88,12.88 42.12,13.12 OK4.1 41.88,13 v40.75,13 | v43.62,17 R12.1
  Bottom 0.203: v43.62,17 40.75,14.12 v40.75,13
N$16
  Top 0.203: D3.1 36.25,11 36.25,12.75 OK3.3 35.88,13.25 41.62,19 R13.1
N$17
  Top 0.203: D4.1 31.25,11 31.25,12.62 30.75,13.12 OK3.1 30.75,13.25 33.38,15.88 37.62,15.88 41.25,19.5 49.5,19.5 51,21 R14.1
N$18
  Bottom 0.203: OK7.3 32.62,13.12 32.62,11.12 D11.1 32.62,11 33.25,10.38 36.12,10.38 36.5,10.75 36.5,14.25 40.5,18.25 45.88,18.25 48.62,21 52.12,21 R3.1
N$19  (via drill 0.41)
  Top 0.203: 24.25,13.12 23.88,12.75 23.88,11 D5.1 | v5.88,16 4.88,15 R15.1 | 24.25,13.12 v21.38,16 | 24.25,13.12 OK2.3
  Bottom 0.203: v21.38,16 v5.88,16
N$20  (via drill 0.41)
  Top 0.203: D6.1 18.88,11 18.88,12.88 19.12,13.12 OK2.1 18.88,13 v14.12,17.75 | R16.1 6.25,17 v7,17.75
  Bottom 0.203: v14.12,17.75 v7,17.75
N$21  (via drill 0.41)
  Top 0.203: D7.1 13.25,11 13.25,12.75 OK1.3 8.5,17.5 v8.5,18.5 | v6.88,19 R17.1
  Bottom 0.203: v6.88,19 8,19 v8.5,18.5
N$22
  Bottom 0.203: D12.1 37.88,11.25 37.88,13.12 OK7.1 37.88,13.25 42.38,17.75 46.75,17.75 47.88,18.88 52.38,18.88 R4.1
N$23
  Top 0.203: D8.1 9.25,11 9.25,11.62 7.75,13.12 OK1.1 7.75,13.25 7.75,19.12 5.88,21 R18.1
N$24  (via drill 0.41)
  Top 0.203: v5.62,22.5 9.62,18.5 16.38,18.5 v20,14.88
  Bottom 0.203: D13.1 21.62,11 21.62,13.12 OK6.3 21.62,13.25 v20,14.88 | v5.62,22.5 3.12,22.5 2.12,21.5 2.12,20.25 2.75,19.62 2.75,19.12 R5.1
N$25
  Bottom 0.203: D14.1 26.62,11.12 26.62,13 26.75,13.12 OK6.1 26.75,13.25 21.5,18.5 10.12,18.5 6.88,21.75 4.12,21.75 3.38,21 3.12,21 R6.1
N$26
  Bottom 0.203: D15.1 10.62,11 10.62,13.12 OK5.3 10.62,13.25 8.88,15 R7.1
N$27  (via drill 0.41)
  Top 0.203: v14.12,14.88 v12,17
  Bottom 0.203: D16.1 15.88,11.12 15.88,13.12 OK5.1 15.75,13.25 v14.12,14.88 | v12,17 R8.1
N$49
  Top 0.203: OK1.2 10.25,13.12 11.62,11.75 11.62,11 D8.2 12,11 13,10 19,10 20.12,7.88 X1.10
N$55
  Top 0.203: 33.31,10.69 31.38,7.75 X1.6 | 33.31,10.69 33.62,11 D4.2 | OK3.2 33.25,13.12 33.25,10.75 33.31,10.69
N$60  (via drill 0.41)
  Top 0.203: OK1.4 15.38,13.12 15.62,12.88 15.62,11 D7.2 v17.88,11
  Bottom 0.203: v17.88,11 18.88,10 21.75,10 22.88,7.88 X1.9
N$61
  Top 0.203: 21.25,11 21.25,12.75 OK2.2 | 21.25,11 22.5,11 24.62,7.88 25.62,7.88 X1.8 | 21.25,11 D6.2
N$62
  Top 0.203: 26.69,10.56 28.5,7.75 X1.7 | 26.69,10.56 26.25,11 D5.2 | OK2.4 26.75,13.12 26.75,10.62 26.69,10.56
N$64
  Top 0.203: 38.62,11 38.62,12.88 38.38,13.12 OK3.4 | 38.62,11 37.62,11 36.62,10 35.25,10 34.12,7.88 X1.5 | 38.62,11 D3.2
N$65  (via drill 0.41)
  Top 0.203: OK4.2 44.25,12.75 44.25,11 D1.2 44.12,11 v43.12,10
  Bottom 0.203: v43.12,10 41.88,10 40.75,7.88 40.75,7.38 40,6.62 38,6.62 36.88,7.75 X1.4
N$66
  Top 0.203: D2.2 48.25,11 48.25,11.62 49.75,13.12 OK4.4 49.75,13.25 48.38,14.62 41.25,14.62 39.62,13 39.62,7.88 X1.3
SDI_MOSI  (via drill 0.41)
  Top 0.203: v51.62,22.12 51,21.5 50.88,21.5 50.75,21.38 41.25,21.38 v39.75,22.88 | v39.88,29 39.88,30.25 40.38,30.75 SERIAL.8 | v38.3,36.97 25.2,36.97 23.37,35.14 20.22,35.14 17.88,37.47 3.96,37.47 1.93,35.44 1.93,31.07 3.66,29.35 3.66,28.23 SERIAL2.8
  Bottom 0.203: v51.62,22.12 54.88,25.38 54.88,26.25 SERIAL1.8 | v39.75,22.88 39.75,26.38 39.5,26.62 39.5,27.5 39.88,27.88 v39.88,29 | v38.3,36.97 41.45,33.82 41.45,31.89 40.44,30.87 SERIAL.8
SDI_SCLK  (via drill 0.41)
  Top 0.203: v9.14,28.23 6.3,28.23 SERIAL2.7 | v43.79,35.44 42.57,35.44 40.44,33.31 SERIAL.7
  Bottom 0.203: SERIAL.7 40.38,33.5 38.38,33.5 38.3,33.51 35.26,36.56 19.2,36.56 10.87,28.23 v9.14,28.23 | SERIAL1.7 52.5,26.38 53.5,27.38 55,27.38 56.5,28.88 56.5,34.62 55,36.12 54.97,36.15 44.5,36.15 v43.79,35.44

### Text on the board
KAP_MAAT1: inverse
_bsilk: PCB-GPI-JACK, v11-16 / SKAARHOJ